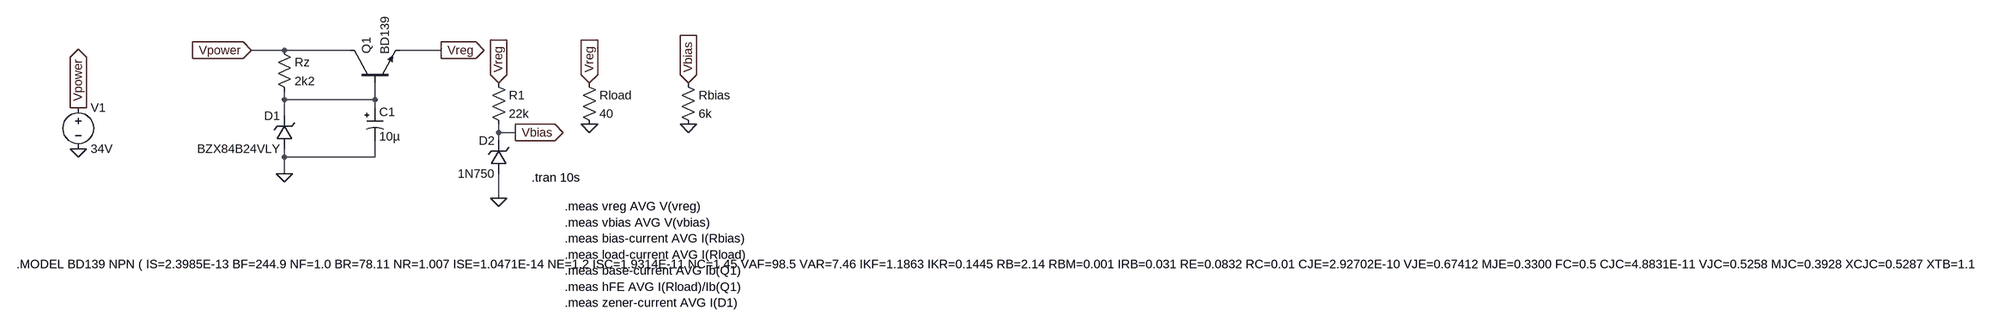
[diagram p0: schematic breadboard.asc]
breadboard.asc, the LTspice schematic file:
Version 4
SHEET 1 4160 680
WIRE 240 192 176 192
WIRE 368 192 240 192
WIRE 544 192 464 192
WIRE 240 288 240 272
WIRE 416 288 416 256
WIRE 416 288 240 288
WIRE 416 304 416 288
WIRE 240 320 240 288
WIRE 656 352 656 336
WIRE 688 352 656 352
WIRE 656 368 656 352
WIRE 240 400 240 384
WIRE 416 400 416 368
WIRE 416 400 240 400
WIRE 240 432 240 400
WIRE 656 480 656 432
FLAG -160 384 0
FLAG -160 304 Vpower
IOPIN -160 304 Out
FLAG 176 192 Vpower
IOPIN 176 192 In
FLAG 240 432 0
FLAG 544 192 Vreg
IOPIN 544 192 Out
FLAG 832 336 0
FLAG 832 256 Vreg
IOPIN 832 256 In
FLAG 656 480 0
FLAG 688 352 Vbias
IOPIN 688 352 Out
FLAG 656 256 Vreg
IOPIN 656 256 In
FLAG 1024 336 0
FLAG 1024 256 Vbias
IOPIN 1024 256 In
SYMBOL npn 368 256 R270
SYMATTR InstName Q1
SYMATTR Value BD139
SYMBOL Res 224 176 R0
SYMATTR InstName Rz
SYMATTR Value 2k2
SYMBOL zener 256 384 R180
WINDOW 0 24 64 Left 2
WINDOW 3 24 0 Left 2
SYMATTR InstName D1
SYMATTR Value BZX84B24VLY
SYMATTR Description Diode
SYMATTR Type diode
SYMBOL Voltage -160 288 R0
SYMATTR InstName V1
SYMATTR Value 34V
SYMBOL polcap 400 304 R0
SYMATTR InstName C1
SYMATTR Value 10µ
SYMBOL Res 816 240 R0
SYMATTR InstName Rload
SYMATTR Value 40
SYMBOL zener 672 432 R180
WINDOW 0 24 64 Left 2
WINDOW 3 24 0 Left 2
SYMATTR InstName D2
SYMATTR Value 1N750
SYMBOL Res 640 240 R0
SYMATTR InstName R1
SYMATTR Value 22k
SYMBOL Res 1008 240 R0
SYMATTR InstName Rbias
SYMATTR Value 6k
TEXT -280 608 Left 2 !.MODEL BD139 NPN ( IS=2.3985E-13 BF=244.9 NF=1.0 BR=78.11 NR=1.007 ISE=1.0471E-14 NE=1.2 ISC=1.9314E-11 NC=1.45 VAF=98.5 VAR=7.46 IKF=1.1863 IKR=0.1445 RB=2.14 RBM=0.001 IRB=0.031 RE=0.0832 RC=0.01 CJE=2.92702E-10 VJE=0.67412 MJE=0.3300 FC=0.5 CJC=4.8831E-11 VJC=0.5258 MJC=0.3928 XCJC=0.5287 XTB=1.1398 EG=1.2105 XTI=3.0 Vceo=80 Icrating=3 mfg=fairchild)
TEXT 720 440 Left 2 !.tran 10s
TEXT 784 496 Left 2 !.meas vreg AVG V(vreg)\n.meas vbias AVG V(vbias)\n.meas bias-current AVG I(Rbias)\n.meas load-current AVG I(Rload)\n.meas base-current AVG Ib(Q1)\n.meas hFE AVG I(Rload)/Ib(Q1)\n.meas zener-current AVG I(D1)

The netlist it stands for:
* breadboard.asc
Q1 Vpower N001 Vreg 0 BD139
Rz Vpower N001 2k2
D1 0 N001 BZX84B24VLY
V1 Vpower 0 34V
C1 N001 0 10µ
Rload Vreg 0 40
D2 0 Vbias 1N750
R1 Vreg Vbias 22k
Rbias Vbias 0 6k
.model D D
.lib standard.dio
.model NPN NPN
.model PNP PNP
.lib standard.bjt
.MODEL BD139 NPN ( IS=2.3985E-13 BF=244.9 NF=1.0 BR=78.11 NR=1.007 ISE=1.0471E-14 NE=1.2 ISC=1.9314E-11 NC=1.45 VAF=98.5 VAR=7.46 IKF=1.1863 IKR=0.1445 RB=2.14 RBM=0.001 IRB=0.031 RE=0.0832 RC=0.01 CJE=2.92702E-10 VJE=0.67412 MJE=0.3300 FC=0.5 CJC=4.8831E-11 VJC=0.5258 MJC=0.3928 XCJC=0.5287 XTB=1.1398 EG=1.2105 XTI=3.0 Vceo=80 Icrating=3 mfg=fairchild)
.tran 10s
.meas vreg AVG V(vreg)
.meas vbias AVG V(vbias)
.meas bias-current AVG I(Rbias)
.meas load-current AVG I(Rload)
.meas base-current AVG Ib(Q1)
.meas hFE AVG I(Rload)/Ib(Q1)
.meas zener-current AVG I(D1)
.backanno
.end